# Altium schematic sheet LED_MAT_HUB.SchDoc: HUB
size A4; Revision: 2.0; SheetNumber: 5; SheetTotal: 7; Engineer: Dim Su; ContentRev1: Original Document; dateREV1: "Aug/08/2018"; dateREV2: "Sep/03/2018"; ContentRev2: No changes; Rev1: V1; Rev2: V2; Project: LED_MAT_3
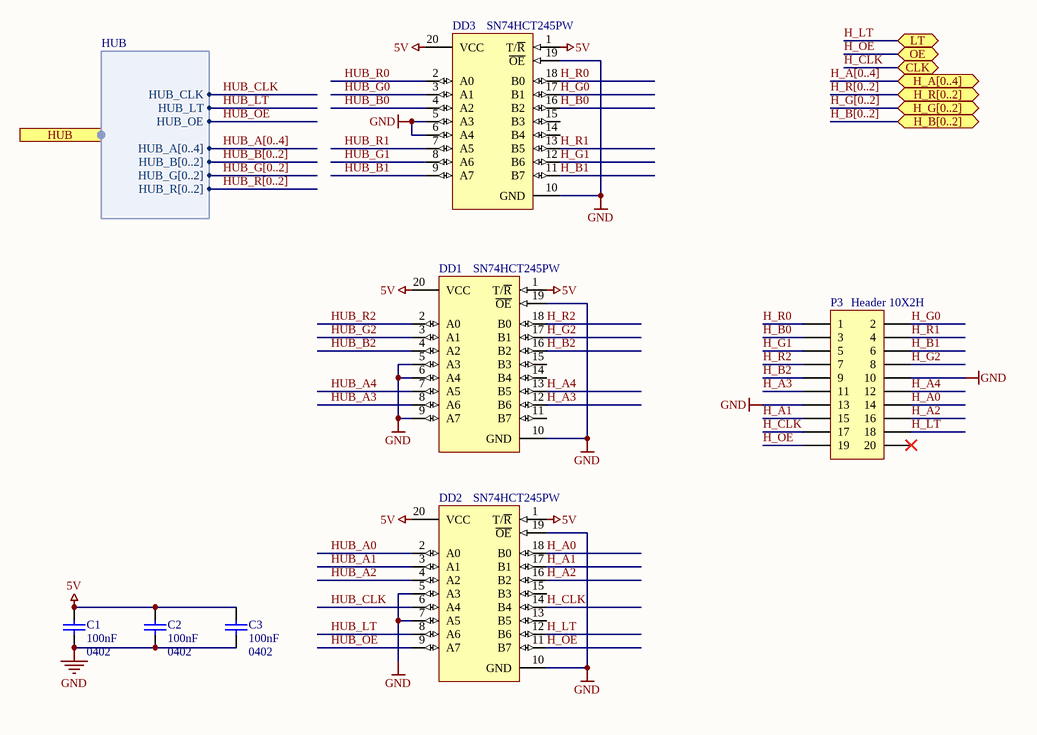
[diagram p0: LED_MAT_HUB.SchDoc]

## Parts
C1  value 100nF  Package: 0402  [CAPC1005L]  (hidden comment: 100nF / 0402 / X7R / 16V)
C2  value 100nF  Package: 0402  [CAPC1005L]  (hidden comment: 100nF / 0402 / X7R / 16V)
C3  value 100nF  Package: 0402  [CAPC1005L]  (hidden comment: 100nF / 0402 / X7R / 16V)
DD1  SN74HCT245PW  [PW020_N]
DD2  SN74HCT245PW  [PW020_N]
DD3  SN74HCT245PW  [PW020_N]
P3  Header 10X2H  [HDR2X10H]

## Ports
CLK (bidir), H_A[0..4] (bidir), H_B[0..2] (bidir), H_G[0..2] (bidir), H_R[0..2] (bidir), HUB (harness HUB), LT (bidir), OE (bidir)

## Harnesses
HUB: HUB_R[0..2], HUB_G[0..2], HUB_B[0..2], HUB_A[0..4], HUB_OE, HUB_LT, HUB_CLK

## Nets
5V: C1.2 C2.2 C3.2 DD1.1(T/~{R}) DD1.20(VCC) DD2.1(T/~{R}) DD2.20(VCC) DD3.1(T/~{R}) DD3.20(VCC)
GND: C1.1 C2.1 C3.1 DD1.5(A3) DD1.6(A4) DD1.9(A7) DD1.10(GND) DD1.19(~{OE}) DD2.5(A3) DD2.7(A5) DD2.10(GND) DD2.19(~{OE}) DD3.5(A3) DD3.6(A4) DD3.10(GND) DD3.19(~{OE}) P3.10 P3.13
H_A0: DD2.18(B0) P3.14
H_A1: DD2.17(B1) P3.15
H_A2: DD2.16(B2) P3.16
H_A3: DD1.12(B6) P3.11
H_A4: DD1.13(B5) P3.12
H_B0: DD3.16(B2) P3.3
H_B1: DD3.11(B7) P3.6
H_B2: DD1.16(B2) P3.9
H_CLK: DD2.14(B4) P3.17 ; port CLK
H_G0: DD3.17(B1) P3.2
H_G1: DD3.12(B6) P3.5
H_G2: DD1.17(B1) P3.8
H_LT: DD2.12(B6) P3.18 ; port LT
H_OE: DD2.11(B7) P3.19 ; port OE
H_R0: DD3.18(B0) P3.1
H_R1: DD3.13(B5) P3.4
H_R2: DD1.18(B0) P3.7
HUB_A0: DD2.2(A0)
HUB_A1: DD2.3(A1)
HUB_A2: DD2.4(A2)
HUB_A3: DD1.8(A6)
HUB_A4: DD1.7(A5)
HUB_B0: DD3.4(A2)
HUB_B1: DD3.9(A7)
HUB_B2: DD1.4(A2)
HUB_CLK: DD2.6(A4) ; port HUB.HUB_CLK
HUB_G0: DD3.3(A1)
HUB_G1: DD3.8(A6)
HUB_G2: DD1.3(A1)
HUB_LT: DD2.8(A6) ; port HUB.HUB_LT
HUB_OE: DD2.9(A7) ; port HUB.HUB_OE
HUB_R0: DD3.2(A0)
HUB_R1: DD3.7(A5)
HUB_R2: DD1.2(A0)

Not connected (* = marked no-connect by the designer): DD1 11(B7) 14(B4) 15(B3); DD2 13(B5) 15(B3); DD3 14(B4) 15(B3); P3 20*

## Buses and harness runs
bus H_A[0..4] = port H_A[0..4]
bus H_B[0..2] = port H_B[0..2]
bus H_G[0..2] = port H_G[0..2]
bus H_R[0..2] = port H_R[0..2]
bus HUB_A[0..4]
bus HUB_B[0..2]
bus HUB_G[0..2]
bus HUB_R[0..2]

## Notes on the sheet
- Title
- Size:
- Date:
- A4
- Number:
- Time:
- Revision:
- Sheet
- of
- File:

## Library data of the parts
C1-C3 = 100nF / 0402 / X7R / 16V: Capacitor ceramic; Manufacturer: SAMSUNG; Manufacturer Part Number: CL05B104KO5NNNC; Voltage: 16V; CompName: Capacitor; Price: 0.2
DD1-DD3 = SN74HCT245PW: Octal 3-State Noninverting Bus Transceiver; Manufacturer: NEXPERIA; CompName: IC; Temperature: -55°C - 125°C; Package: SO-20; Manufacturer Part Number: SN74HCT245PW; Price: 3.14
P3 = Header 10X2H: Header, 10-Pin, Dual row, Right Angle; CompName: Connector; Price: .5